# EAGLE design cc1101-2ch-dimmer (EAGLE 9.4.2)
Assembly variants: AVR TH/P/L, AVR P/L, AVR L
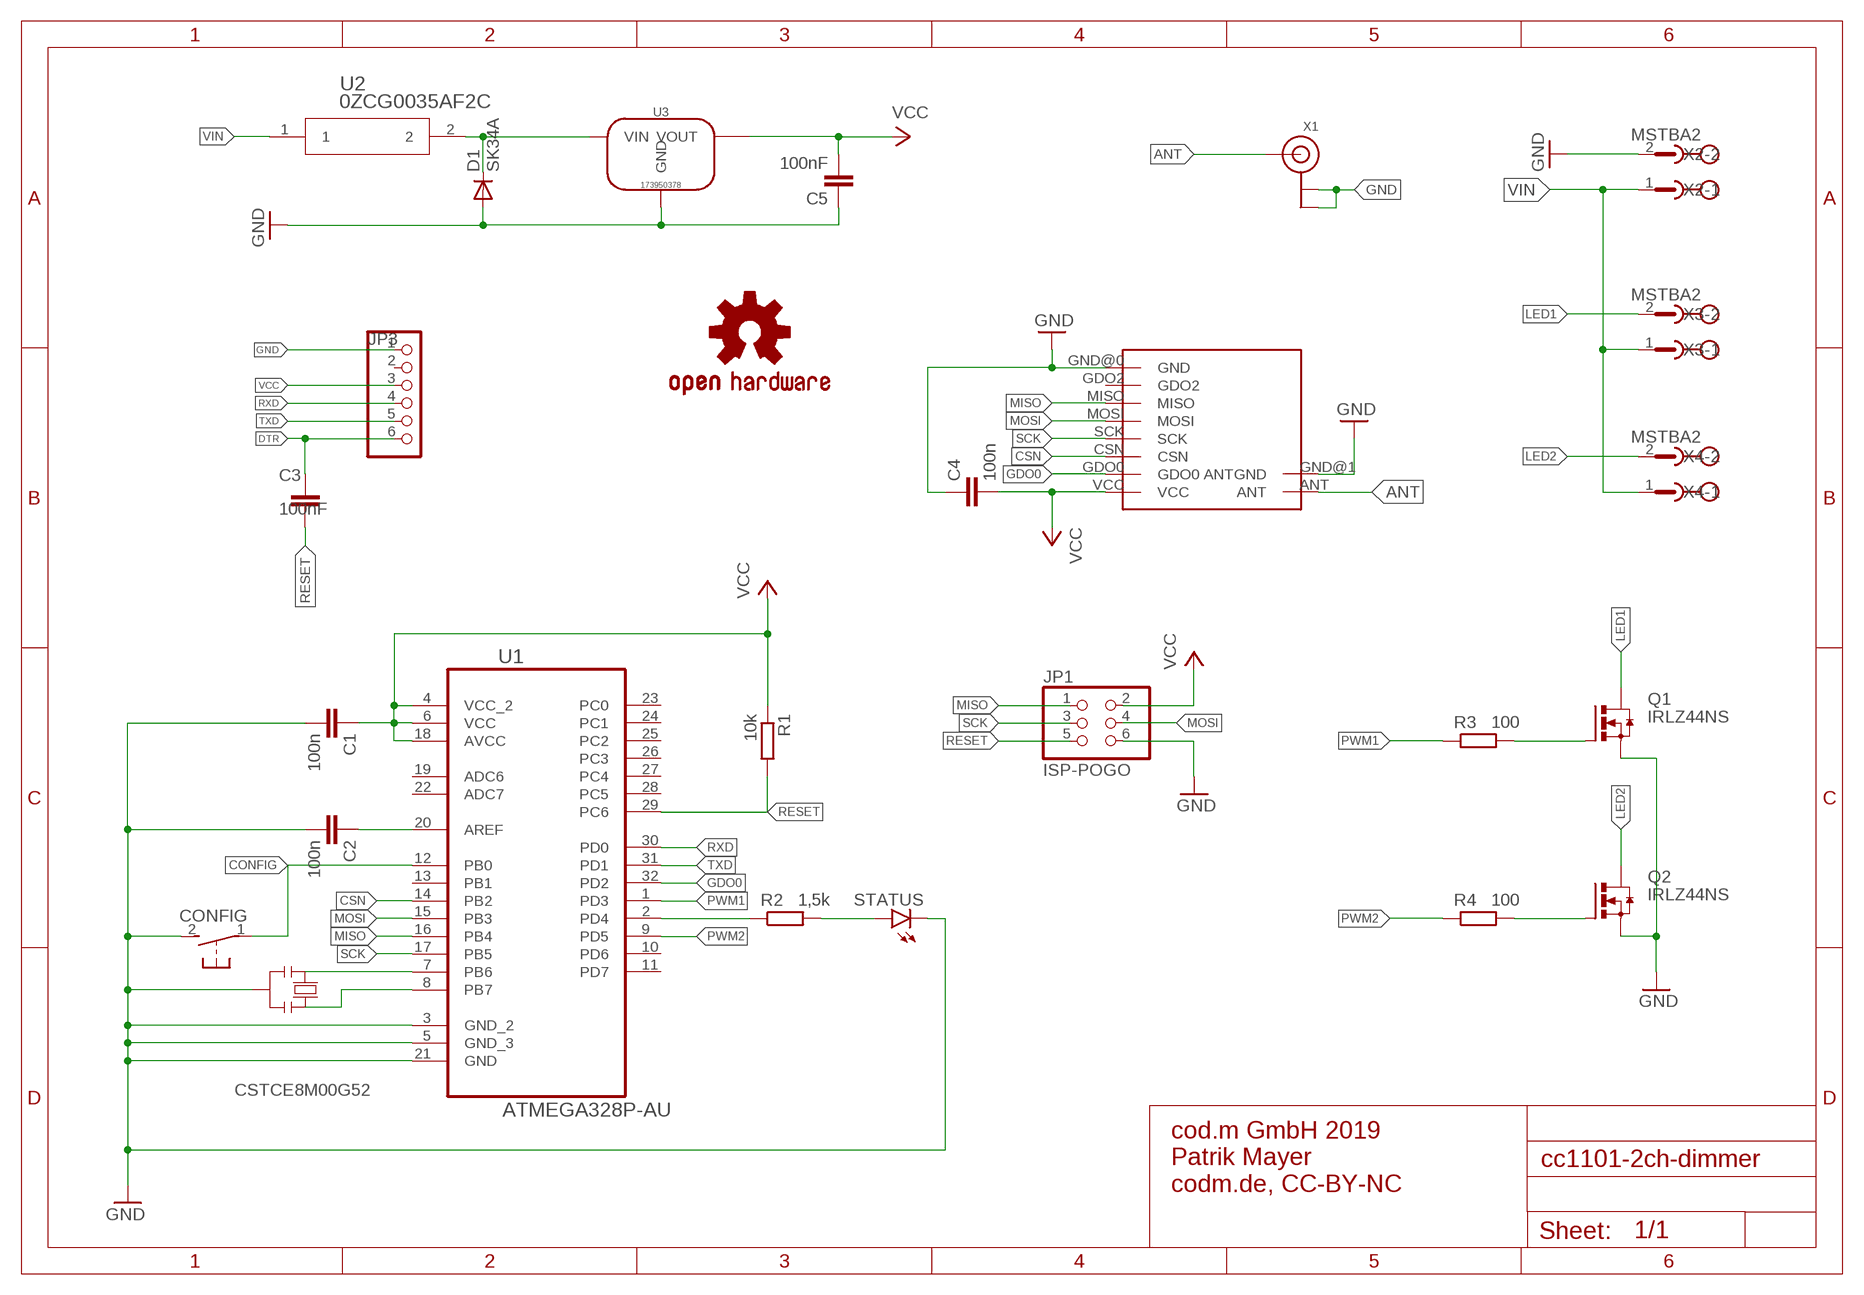
[diagram p0: schematic, sheet 1]

## Parts
C1  100n  C-EUC0805  [C0805]
C2  100n  C-EUC0805  [C0805]
C3  100nF  C-EUC0805  [C0805]
C4  100n  C-EUC0805  [C0805]
C5  100nF  C-EUC0805  [C0805]
CONFIG  31-XX  [B3F-31XX]
D1  SK34A  DIODE-DO214AC  [DO214AC]
JP1  ISP-POGO  PINHD6-CLEAN  [2X03]
JP3  PINHD-1X6  [1X06]
LOGO1  OSHW-LOGOM  [OSHW-LOGO-M]
Q1  IRLZ44NS  IRLZ44NSD2PAK  [D2PAK]
Q2  IRLZ44NS  IRLZ44NSD2PAK  [D2PAK]
R1  10k  R-EU_R0805  [R0805]
R2  1,5k  R-EU_R0805  [R0805]
R3  100  R-EU_R0805  [R0805]
R4  100  R-EU_R0805  [R0805]
STATUS  LEDCHIPLED_0805  [CHIPLED_0805]
U1  ATMEGA328P-AU  [QFP80P900X900X120-32N]
U2  0ZCG0035AF2C  [0ZCG]
U3  173950378  [SIP-3]
U$1  CC1101-868MS10  [CC1101-868MS10]
X1  ANTENNA_U.FL  [U.FL]
X2  MSTBA2  [MSTBA2]
X3  MSTBA2  [MSTBA2]
X4  MSTBA2  [MSTBA2]
Y1  CSTCE8M00G52  RESONATORMU  [RESONATOR]

## Nets
ANT: U$1.ANT X1.3(SIGNAL)
CONFIG: CONFIG.1(P) U1.12(PB0)
CSN: U1.14(PB2) U$1.CSN
DTR: C3.1 JP3.6
GDO0: U1.32(PD2) U$1.GDO0
GND: C1.2 C2.2 C4.1 C5.1 CONFIG.2(S) D1.A JP1.6 JP3.1 Q1.3(S) Q2.3(S) STATUS.C U1.3(GND_2) U1.5(GND_3) U1.21(GND) U3.P$2(GND) U$1.GND@0(GND) U$1.GND@1(ANTGND) X1.1(GND) X1.2(GND) X2.2 Y1.2
LED1: Q1.2(D) X3.2
LED2: Q2.2(D) X4.2
MISO: JP1.1 U1.16(PB4) U$1.MISO
MOSI: JP1.4 U1.15(PB3) U$1.MOSI
N$1: R2.1 U1.2(PD4)
N$2: R2.2 STATUS.A
N$3: Q2.1(G) R4.2
N$4: U1.7(PB6) Y1.1
N$5: Q1.1(G) R3.2
N$6: C2.1 U1.20(AREF)
N$7: U1.8(PB7) Y1.3
N$8: D1.C U2.2 U3.P$1(VIN)
PWM1: R3.1 U1.1(PD3)
PWM2: R4.1 U1.9(PD5)
RESET: C3.2 JP1.5 R1.2 U1.29(PC6)
RXD: JP3.4 U1.30(PD0)
SCK: JP1.3 U1.17(PB5) U$1.SCK
TXD: JP3.5 U1.31(PD1)
VCC: C1.1 C4.2 C5.2 JP1.2 JP3.3 R1.1 U1.4(VCC_2) U1.6(VCC) U1.18(AVCC) U3.P$3(VOUT) U$1.VCC
VIN: U2.1 X2.1 X3.1 X4.1
Unconnected: JP3.2 U1.10(PD6) U1.11(PD7) U1.13(PB1) U1.19(ADC6) U1.22(ADC7) U1.23(PC0) U1.24(PC1) U1.25(PC2) U1.26(PC3) U1.27(PC4) U1.28(PC5) U$1.GDO2

## Notes on the sheet
- cod.m GmbH 2019
  Patrik Mayer 
  codm.de, CC-BY-NC

## Library data of the parts
C1-C5 = rcl:C-EU: CAPACITOR, European symbol; SPICEPREFIX: C
CONFIG = switch-omron:31-XX: OMRON SWITCH; MPN: B3F-3100; OC_FARNELL: 959704; OC_NEWARK: 36M3582
D1 = diode:DIODE-: DIODE
JP1 = codm:PINHD6-CLEAN
JP3 = pinhead:PINHD-1X6: PIN HEADER
LOGO1 = SparkFun-Aesthetics:OSHW-LOGO: Open-Source Hardware (OSHW) Logo This logo indicates the piece of hardware it is found on incorporates a OSHW license and/or adheres to the definition of open source hardware found here: http://freedomdefined.org/OSHW
Q1 Q2 = codm:IRLZ44NS
R1-R4 = rcl:R-EU_: RESISTOR, European symbol; SPICEPREFIX: R
STATUS = led:LED: LED OSRAM: - CHIPLED LG R971, LG N971, LY N971, LG Q971, LY Q971, LO R971, LY R971 LH N974, LH R974 LS Q976, LO Q976, LY Q976 LO Q996 - Hyper CHIPLED LW Q18S LB Q993, LB Q99A, LB R99A - SideLED LS A670, LO A670, LY A670, LG A670, LP A670 LB A673, LV A673, LT A673, LW A673 LH A674 LY A675 LS A676, LA A676, LO A676, LY A676, LW A676 LS A679, LY A679, LG A679 - Hyper Micro SIDELED® LS Y876, LA Y876, LO Y876, LY Y876 LT Y87S - SmartLED LW L88C, LW L88S LB L89C, LB L89S, LG L890 LS L89K, LO L89K, LY L89K LS L896, LA L896, LO L896, LY L896 - TOPLED LS T670, LO T670, LY T670, LG T670, LP T670 LSG T670, LSP T670, LSY T670, LOP T670, LYG T670 LG T671, LOG T671, LSG T671 LB T673, LV T673, LT T673, LW T673 LH T674 LS T676, LA T676, LO T676, LY T676, LB T676, LH T676, LSB T676, LW T676 LB T67C, LV T67C, LT T67C, LS T67K, LO T67K, LY T67K, LW E67C LS E67B, LA E67B, LO E67B, LY E67B, LB E67C, LV E67C, LT E67C LW T67C LS T679, LY T679, LG T679 LS T770, LO T770, LY T770, LG T770, LP T770 LB T773, LV T773, LT T773, LW T773 LH T774 LS E675, LA E675, LY E675, LS T675 LS T776, LA T776, LO T776, LY T776, LB T776 LHGB T686 LT T68C, LB T68C - Hyper Mini TOPLED® LB M676 - Mini TOPLED Santana® LG M470 LS M47K, LO M47K, LY M47K Source: http://www.osram.convergy.de LUXEON: - LUMILED® LXK2-PW12-R00, LXK2-PW12-S00, LXK2-PW14-U00, LXK2-PW14-V00 LXK2-PM12-R00, LXK2-PM12-S00, LXK2-PM14-U00 LXK2-PE12-Q00, LXK2-PE12-R00, LXK2-PE12-S00, LXK2-PE14-T00, LXK2-PE14-U00 LXK2-PB12-K00, LXK2-PB12-L00, LXK2-PB12-M00, LXK2-PB14-N00, LXK2-PB14-P00, LXK2-PB14-Q00 LXK2-PR12-L00, LXK2-PR12-M00, LXK2-PR14-Q00, LXK2-PR14-R00 LXK2-PD12-Q00, LXK2-PD12-R00, LXK2-PD12-S00 LXK2-PH12-R00, LXK2-PH12-S00 LXK2-PL12-P00, LXK2-PL12-Q00, LXK2-PL12-R00 Source: www.luxeon.com KINGBRIGHT: KA-3528ASYC Source: www.kingbright.com
U1 = Atmel_By_element14_Batch_1-00:ATMEGA328P-AU: 8-bit Microcontroller with In-System Programmable Flash; MPN: ATMEGA328P-AU; OC_FARNELL: 1715486; OC_NEWARK: 14R4631; PACKAGE: TQFP-32; SUPPLIER: Atmel
U2 = 0ZCG0035AF2C:0ZCG0035AF2C; MANUFACTURER_PART_NUMBER: 0ZCG0035AF2C; VENDOR: Belfuse
U3 = 173950378:173950378: MagI³C-FDSM Fixed Step Down Regulator Module Description Simplest design (no power supply knowledge required) Leaded through-hole package for easy manufacturing and prototyping Stand alone solution (CIN and COUT integrated, no external components) L78x series linear regulator replacement (no heatsink required) Low conducted and radiated EMI (compliant to EN55022 class B) <http://katalog.we-online.de/media/images/v2/Family_MAGIC-FDSM_173950x378.jpg>; AVAILABILITY: Unavailable; DESCRIPTION: DC/DC Converter IC [Würth Elektronik] 173950378 DC/DC Converter IC; MF: Wurth Electronics; MP: 173950378; PACKAGE: SIP-3 Würth Elektronik; PRICE: None
U$1 = codm:CC1101-868MS10
X1 = adafruit:ANTENNA_U.FL: U.FL Antenna Connector
X2-X4 = con-phoenix-508:MSTBA2: PHOENIX; MF: FARNELL; MPN: 1757242; OC_FARNELL: 3705171; OC_NEWARK: 71C4161
Y1 = SmartPrj:RESONATOR

## Net classes
1 power: width 0.254 mm, drill 0.61 mm, clearance 0.203 mm

## Board
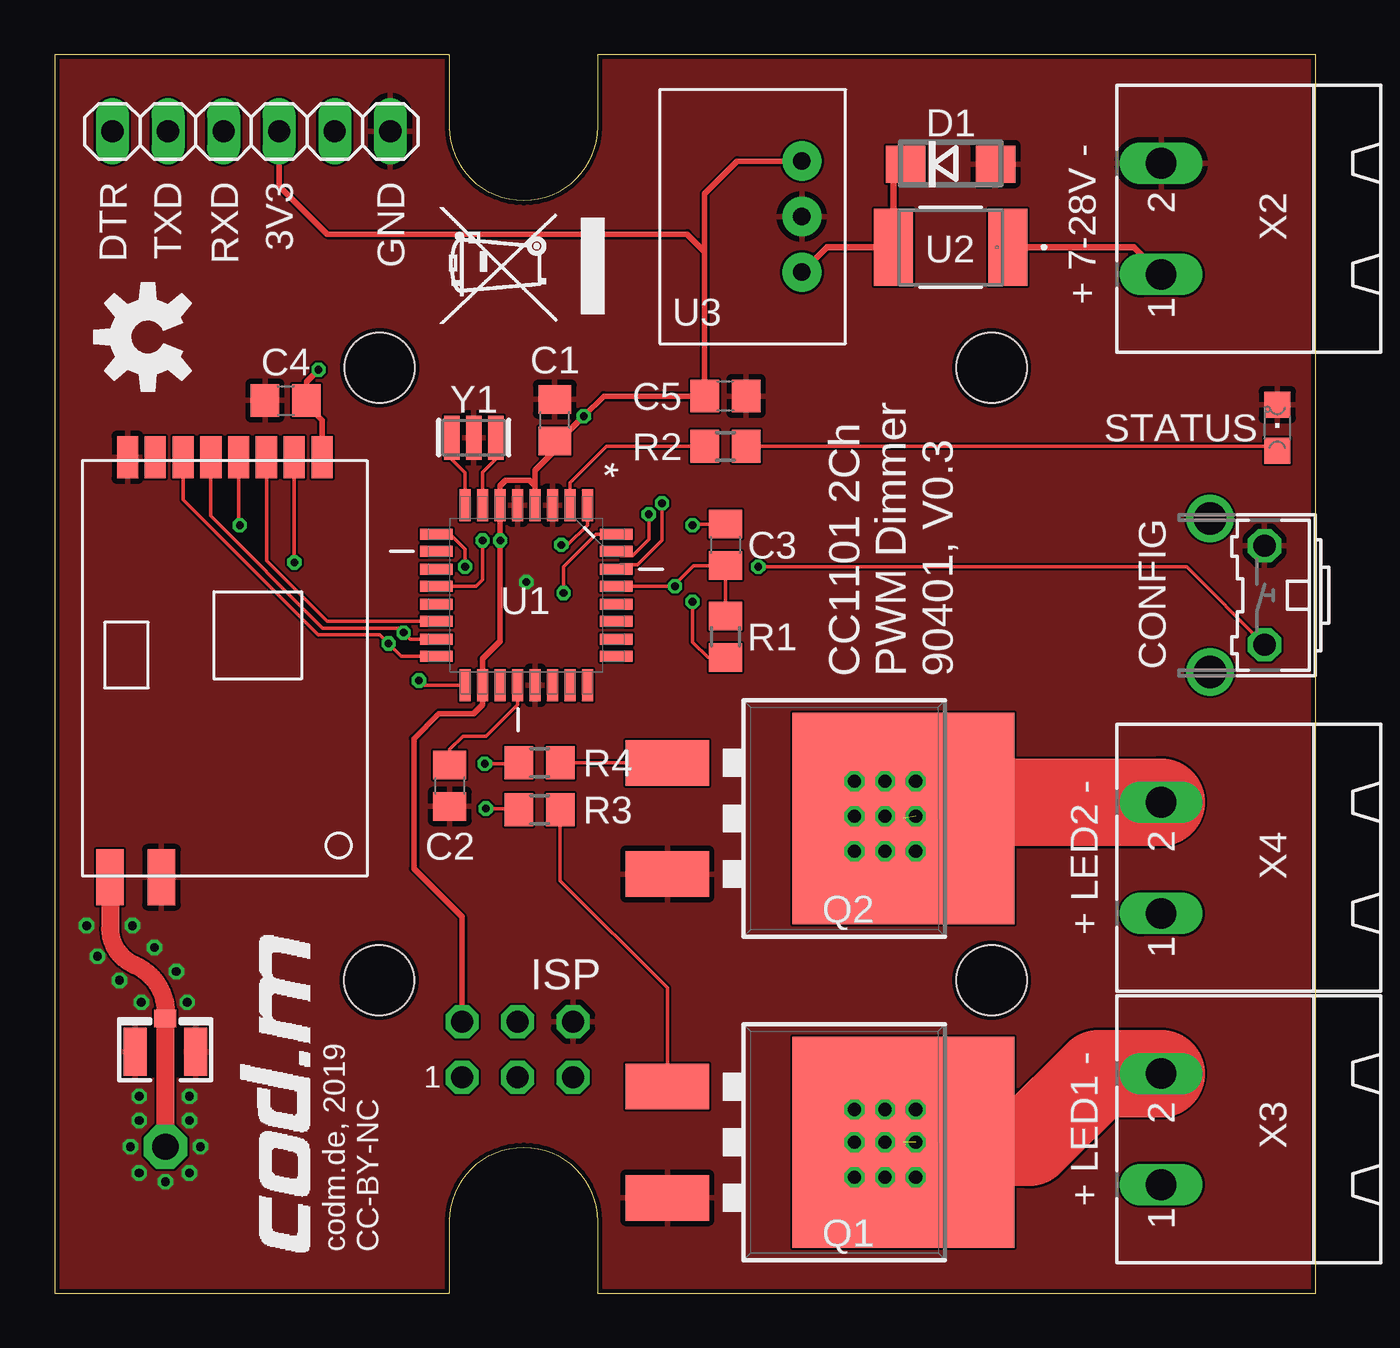
[diagram p1: board, top side]
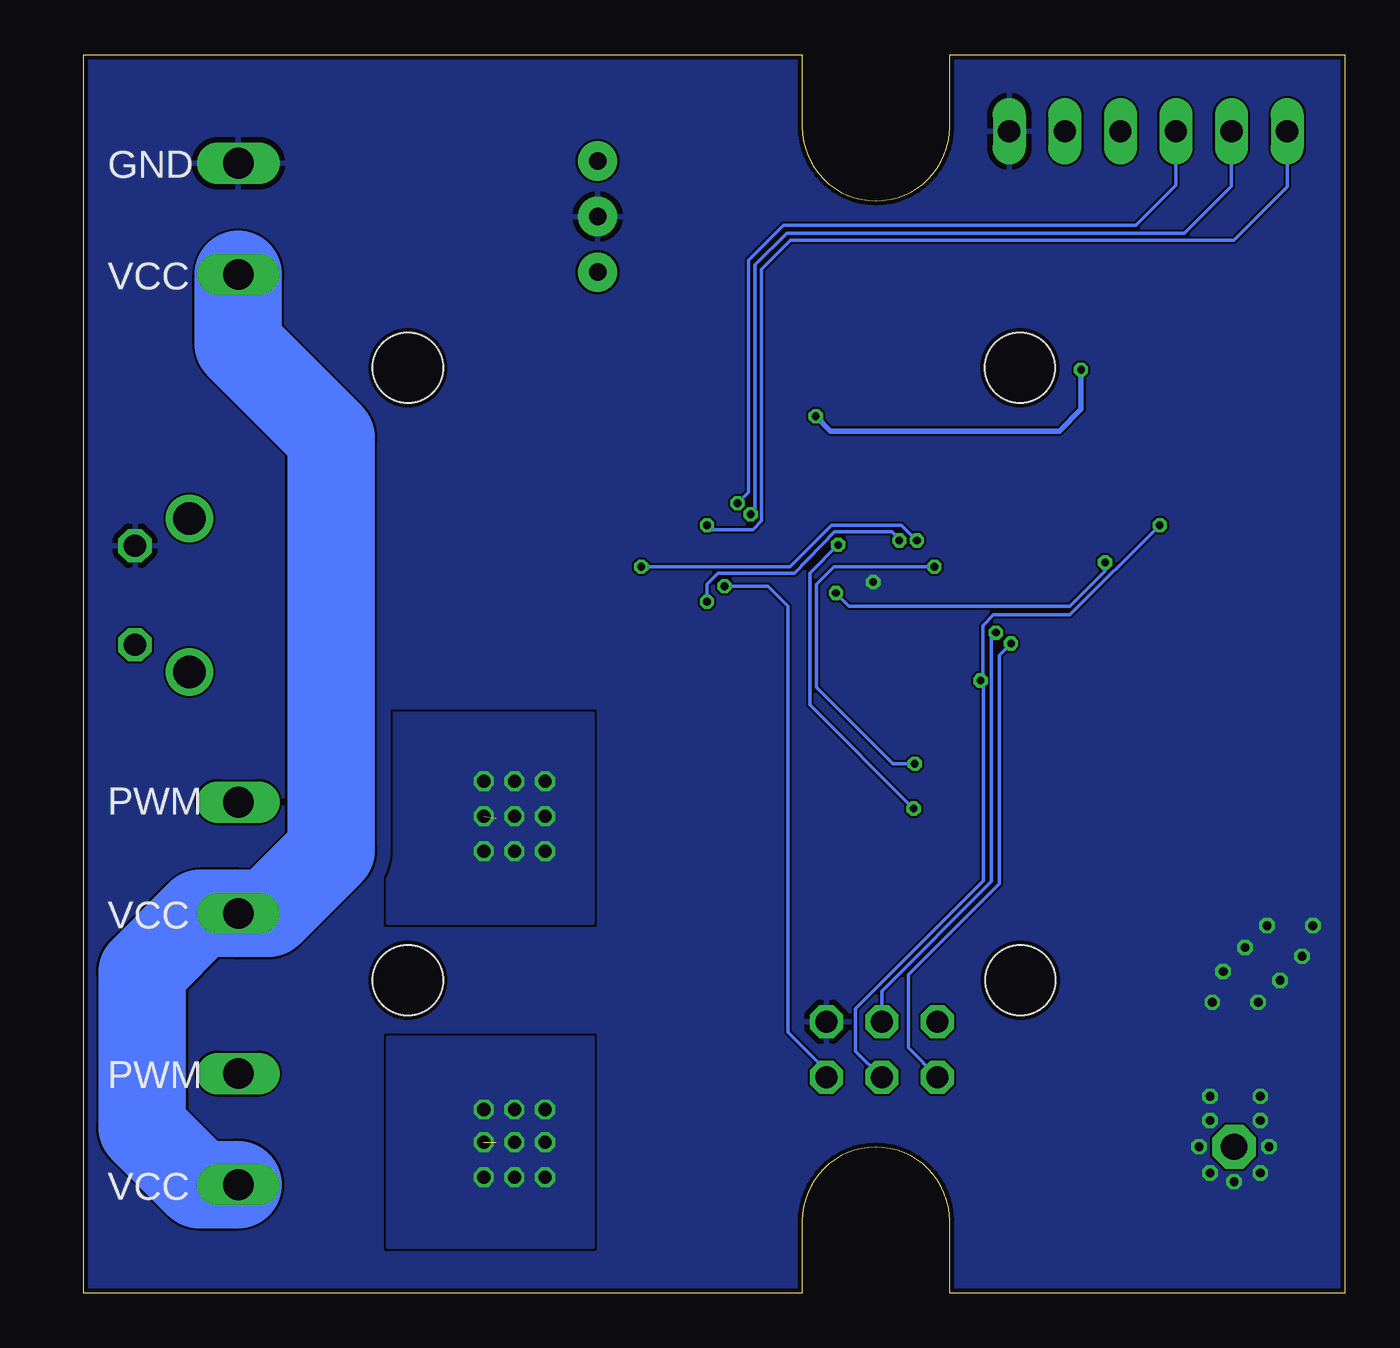
[diagram p2: board, bottom side, seen from below]

Size 57.66 x 56.6 mm. Coordinates in mm from the lower left corner, seen from the top.
Outline: 57.66,0 57.66,56.6 24.81,56.6 24.81,53.3 arc-180 18.06,53.3 18.06,56.6 0,56.6 0,0 18.06,0 18.06,3.3 arc-180 24.81,3.3 24.81,0 57.66,0
Copper layers (1*16): Top 0.035mm / dielectric 1.5mm / Bottom 0.035mm
Design rules "aisler_2_layer": minimum track width 0.1mm, minimum drill 0.2mm, track to track 0.1mm, track to pad 0.1mm, pad to pad 0.1mm, via to via 0.1mm, smd to smd 0.1mm, copper to edge 0.2mm, drill to drill 0.21mm, minimum pad ring 0.25mm, minimum via ring 0.15mm, stop-mask expansion 0mil, vias tented up to drill 0mil, thermal gap 10mil
Holes 3.2 mm at 14.83,14.3 14.86,42.3 42.83,14.3 42.83,42.3

### Footprints (pad centres in the part's own frame; a part is rotated, then mirrored left to right if it is on the bottom)
C0805 = smd 1.3 x 1.5: 1 -0.95,0; 2 0.95,0
B3F-31XX = drill 1.016 octagon: 1 -2.261,-1.245; 2 2.261,-1.245 | drill 1.499 pad 2.159: 3 -3.505,1.245; 4 3.505,1.245
DO214AC = smd 1.8 x 1.7: A 2.05,0; C -2.05,0
2X03 = drill 1.016 octagon: 1 -2.54,-1.27; 2 -2.54,1.27; 3 0,-1.27; 4 0,1.27; 5 2.54,-1.27; 6 2.54,1.27
1X06 = drill 1.016 long: 1 -6.35,0; 2 -3.81,0; 3 -1.27,0; 4 1.27,0; 5 3.81,0; 6 6.35,0
D2PAK = smd 2.08 x 3.81: 1 -2.54,-8.255; 3 2.54,-8.255 | smd 9.652 x 10.16: 2 0,2.54
R0805 = smd 1.3 x 1.5: 1 -0.95,0; 2 0.95,0
CHIPLED_0805 = smd 1.2 x 1.2: A 0,-1.05; C 0,1.05
QFP80P900X900X120-32N = smd 1.473 x 0.508: 1 -4.115,2.794; 2 -4.115,2.007; 3 -4.115,1.194; 4 -4.115,0.406; 5 -4.115,-0.406; 6 -4.115,-1.194; 7 -4.115,-2.007; 8 -4.115,-2.794; 17 4.115,-2.794; 18 4.115,-2.007; 19 4.115,-1.194; 20 4.115,-0.406; 21 4.115,0.406; 22 4.115,1.194; 23 4.115,2.007; 24 4.115,2.794 | smd 0.508 x 1.473: 9 -2.794,-4.115; 10 -2.007,-4.115; 11 -1.194,-4.115; 12 -0.406,-4.115; 13 0.406,-4.115; 14 1.194,-4.115; 15 2.007,-4.115; 16 2.794,-4.115; 25 2.794,4.115; 26 2.007,4.115; 27 1.194,4.115; 28 0.406,4.115; 29 -0.406,4.115; 30 -1.194,4.115; 31 -2.007,4.115; 32 -2.794,4.115
0ZCG = smd 1.778 x 3.505: 1 -2.616,0; 2 2.616,0
SIP-3 = drill 0.8 pad 1.8: P$1 -2.54,2; P$2 0,2; P$3 2.54,2
CC1101-868MS10 = smd 2.54 x 1.27: ANT 19.05,1.25; GND@1 19.05,3.6 | smd 1.93 x 0.965: CSN -0.15,8.4; GDO0 -0.15,9.67; GDO2 -0.15,3.32; GND@0 -0.15,2.05; MISO -0.15,4.59; MOSI -0.15,5.86; SCK -0.15,7.13; VCC -0.15,10.95
U.FL = smd 2.2 x 1.05: 1 0,1.375; 2 0,-1.375 | smd 0.8 x 1: 3 1.525,0
MSTBA2 = drill 1.397 long: 1 -2.54,5.08; 2 2.54,5.08
RESONATOR = smd 0.7 x 2: 1 -1,0; 2 0,0; 3 1,0

### Placement (x,y rotation side)
C1  22.86,39.9 90 top
C2  18.06,23.2 270 top
C3  30.66,34.2 270 top
C4  10.56,40.8 0 top
C5  30.66,41 180 top
CONFIG  54.06,31.9 90 top
D1  40.96,51.6 0 top
JP1  21.16,11.14 0 top
JP3  8.99,53.1 180 top
LOGO1  4.26,43.7 90 top
Q1  36.26,6.9 270 top
Q2  36.26,21.7 270 top
R1  30.66,30.01 90 top
R2  30.67,38.7 0 top
R3  22.16,22.1 0 top
R4  22.16,24.25 0 top
STATUS  55.89,39.55 0 top
U1  21.56,31.9 270 top
U2  40.96,47.8 180 top
U3  36.16,49.2 90 top
U$1  1.28,38.06 270 top
U$2  [CODM-LOGO]  11.66,1.9 90 top
U$3  [WEEE-LOGO-5MM]  25.14,44.31 90 top
X1  5.06,11.03 90 top
X2  55.66,49.1 90 top
X3  55.66,7.5 90 top
X4  55.66,19.9 90 top
Y1  19.16,39.1 180 top

### Tracks (layer width: path | path; a pad name or v marks a point on that pad's centre or on a via)
ANT  (via drill 1.2 pad 2)
  Top 0.813: v5.06,6.7 X1.3 arc73 3.66,15 arc-65 2.53,16.64 U$1.ANT
CONFIG  (via drill 0.35)
  Top 0.152: U1.12 18.75,32.31 18.76,32.3 19.26,32.3 19.56,32.6 v19.56,34.4 | v32.16,33.2 51.74,33.2 CONFIG.1
  Bottom 0.152: v19.56,34.4 20.26,35.1 23.46,35.1 25.36,33.2 v32.16,33.2
CSN
  Top 0.152: U1.14 12.45,30.71 9.68,33.48 U$1.CSN
DTR  (via drill 0.35)
  Top 0.152: v29.16,35.1 29.21,35.15 C3.1
  Bottom 0.152: v29.16,35.1 28.96,34.9 27.06,34.9 26.66,35.3 26.66,46.8 25.34,48.12 5.08,48.12 2.64,50.57 JP3.6
GDO0  (via drill 0.35)
  Top 0.152: U1.32 24.75,34.69 23.26,33.2 v23.26,32 | v10.96,33.4 v10.95,33.41 U$1.GDO0
  Bottom 0.152: v23.26,32 22.66,31.4 12.56,31.4 10.96,33 v10.96,33.4
GND  (via drill 0.35, 0.4)
  other vias: 6.16,7.9 6.66,6.7 6.16,5.5 5.06,5.1 3.86,5.5 3.46,6.7 3.86,7.9 3.56,16.8 4.56,15.8 5.56,14.7 6.06,13.3 3.96,13.3 2.96,14.3 1.96,15.4 1.46,16.8 6.16,9 3.86,9 21.56,32.5
  pour Top: -0.14,-0.1 -0.14,56.9 57.86,56.9 57.86,-0.1
  pour Bottom (rank 2): -0.14,56.9 -0.14,-0.1 57.86,-0.1 57.86,56.9
LED1  (via drill 0.6)  (1 unrouted)
  Top 4: X3.2 47.7,10.04 44.56,6.9 v37.96,6.9
  other vias: 36.56,8.4 37.96,8.4 39.36,8.4 36.56,6.9 39.36,6.9 36.56,5.3 37.96,5.3 39.36,5.3
  pour Bottom (isolate 0.61): 34.36,11.7 34.36,2.1 43.76,2.1 43.76,11.7
LED2  (via drill 0.6)  (1 unrouted)
  Top 4: Q2.2 39.5,22.44 X4.2
  other vias: 36.56,23.4 37.96,23.4 39.36,23.4 36.56,21.8 37.96,21.8 39.36,21.8 36.56,20.2 37.96,20.2 39.36,20.2
  pour Bottom (isolate 0.813): 34.36,26.5 34.36,16.9 43.76,16.9 43.76,26.5
MISO  (via drill 0.35)
  Top 0.152: U$1.MISO 5.87,36.26 12.04,30.09 14.86,30.09 v15.26,29.69 15.85,29.11 U1.16
  Bottom 0.152: JP1.1 19.96,11.21 19.96,14.55 15.8,18.72 15.8,29.15 v15.26,29.69
MOSI  (via drill 0.35)
  Top 0.152: U1.15 16.25,29.89 v15.95,30.19 15.74,30.39 12.25,30.39 7.14,35.52 U$1.MOSI
  Bottom 0.152: JP1.4 21.16,13.81 16.15,18.82 16.15,29.99 v15.95,30.19
N$1
  Top 0.152: R2.1 25.22,38.7 23.57,37.05 U1.2
N$2
  Top 0.152: STATUS.A 55.69,38.7 R2.2
N$3
  Top 0.152: Q2.1 R4.2
N$4
  Top 0.152: Y1.1 20.16,38.12 19.55,37.52 U1.7
N$5
  Top 0.152: Q1.1 28,13.96 23.11,18.85 R3.2
N$6
  Top 0.152: C2.1 18.06,24.85 18.66,25.45 19.71,25.45 21.15,26.89 U1.20
N$7
  Top 0.152: Y1.3 18.16,38.1 18.77,37.49 U1.8
N$8
  Top 0.254: D1.C 38.53,51.23
  Top 0.305: U3.P$1 35.3,47.8 U2.2 38.34,51.03 38.53,51.23
PWM1  (via drill 0.35)
  Top 0.152: U1.1 24.35,35.09 23.45,34.2 v23.16,34.2 | v19.71,22.15 21.16,22.15 R3.1
  Bottom 0.152: v23.16,34.2 24.46,32.9 24.46,26.9 v19.71,22.15
PWM2  (via drill 0.35)
  Top 0.152: U1.9 18.07,34.69 18.76,34 v18.76,33.2 | v19.66,24.2 21.16,24.2 R4.1
  Bottom 0.152: v18.76,33.2 23.36,33.2 24.16,32.4 24.16,27.7 20.66,24.2 v19.66,24.2
RESET  (via drill 0.35)
  Top 0.152: U1.29 v28.36,32.31 28.36,32.4 29.21,33.25 C3.2 R1.2
  Bottom 0.152: JP1.5 23.7,10.17 25.46,11.93 25.46,31.4 26.37,32.31 v28.36,32.31
RXD  (via drill 0.35)
  Top 0.152: U1.30 25.88,33.29 26.65,33.29 27.76,34.4 v27.76,36.1
  Bottom 0.152: v27.76,36.1 27.26,36.6 27.26,47.2 25.66,48.8 9.56,48.8 7.72,50.64 JP3.4
SCK  (via drill 0.35)
  Top 0.152: v8.46,35.1 8.41,35.15 U$1.SCK | U1.17 16.86,27.79 v16.65,28
  Bottom 0.152: JP1.3 22.36,11.07 22.36,13 16.52,18.84 16.52,27.86 v16.65,28 16.55,28.1 16.55,30.51 16.06,31 12.56,31 v8.46,35.1
TXD  (via drill 0.35)
  Top 0.152: U1.31 25.88,33.71 26.42,33.71 27.16,34.45 v27.16,35.6
  Bottom 0.152: v27.16,35.6 26.96,35.8 26.96,47 25.51,48.45 7.33,48.45 5.18,50.6 JP3.5
VCC  (via drill 0.35)
  Top 0.152: R1.1 29.86,29.06 29.16,29.76 v29.16,31.6
  Top 0.254: 29.71,47.6 29.71,50.25 31.2,51.74 U3.P$3 | JP3.3 10.26,50.6 12.46,48.4 28.91,48.4 29.71,47.6 | U$1.VCC 12.23,39.9 11.51,40.62 C4.2 11.51,41.65 v12.06,42.2 | U1.4 21.97,36.5 | 21.97,36.5 21.97,36.89 21.71,37.15 20.61,37.15 20.36,36.9 20.36,36.02 U1.6 v20.37,34.4 20.37,29.81 19.55,28.99 U1.18 19.55,26.88 19.15,26.48 17.55,26.48 16.42,25.35 16.42,19.41 18.62,17.21 JP1.2 | 21.97,36.5 21.96,36.51 21.96,37.6 22.86,38.5 C1.1 23.06,38.95 v24.18,40.07 25.11,41 C5.2 29.71,47.6
  Bottom 0.152: v20.37,34.4 20.37,34.47 20.69,34.8 23.33,34.8 25.16,32.9 28.66,32.9 29.16,32.4 v29.16,31.6
  Bottom 0.254: v12.06,42.2 12.06,40.4 13.06,39.4 23.51,39.4 v24.18,40.07
VIN
  Top 0.305: U2.1 49.34,47.8 X2.1
  Bottom 4: X3.1 52.38,4.96 54.98,7.56 54.98,14.7 52.32,17.36 X4.1 49.2,17.36 46.33,20.23 46.33,39.11 50.58,43.36 X2.1

### Text on the board
tNames: DTR | TXD | RXD | 3V3 | GND | + 7-28V - | CC1101 2Ch / PWM Dimmer / 90401, V0.3 | + LED2 - | ISP | 1 | + LED1 - | codm.de, 2019 / CC-BY-NC
bNames: GND | VCC | PWM | VCC | PWM | VCC